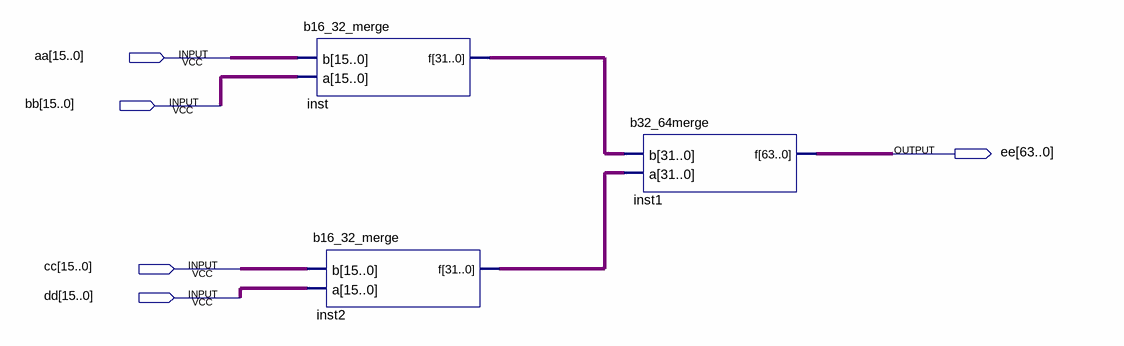
[diagram p0: schematic sheet]
// Quartus schematic b16_64_merge.bdf as structural Verilog: 3 symbols, 5 pins
module b16_64_merge (
  input  [15:0] aa,
  input  [15:0] bb,
  input  [15:0] cc,
  input  [15:0] dd,
  output [63:0] ee
);

  wire [31:0] inst2_f, inst_f;

  b16_32_merge inst (.b(aa), .a(bb), .f(inst_f));
  b16_32_merge inst2 (.b(cc), .a(dd), .f(inst2_f));
  b32_64merge inst1 (.b(inst_f), .a(inst2_f), .f(ee));
endmodule
